# Altium schematic sheet BPDC high.SchDoc
size A
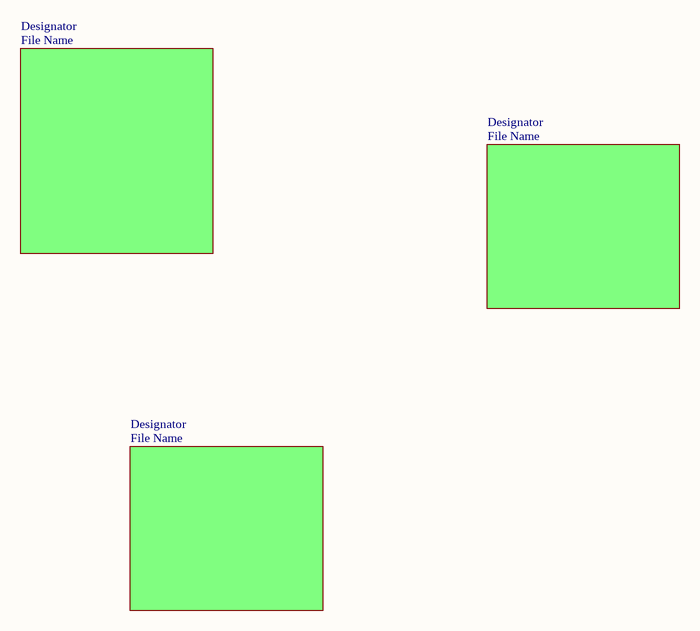
[diagram p0: BPDC high.SchDoc]

## Sub-sheets
Designator = File Name: no entries
Designator = File Name: no entries
Designator = File Name: no entries